# EAGLE design untitled (EAGLE 7.7.0)
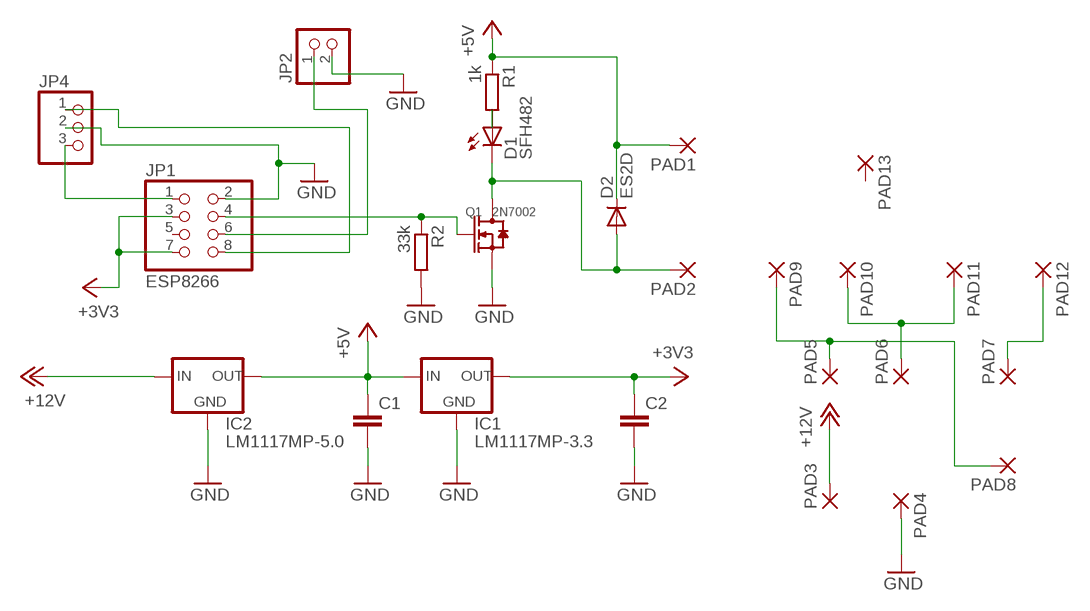
[diagram p0: schematic, sheet 1]

## Parts
C1  C-EUC1812  [C1812]
C2  C-EUC1812  [C1812]
D1  SFH482  [SFH482]
D2  ES2D  [SMB]
IC1  LM1117MP-3.3  [SOT223]
IC2  LM1117MP-5.0  [SOT223]
JP1  ESP8266  PINHD-2X4  [2X04]
JP2  PINHD-1X2  [1X02]
JP4  PINHD-1X3  [1X03]
PAD1  3,17/1,1  [3,17/1,1]
PAD2  3,17/1,1  [3,17/1,1]
PAD3  3,17/1,1  [3,17/1,1]
PAD4  3,17/1,1  [3,17/1,1]
PAD5  3,17/1,1  [3,17/1,1]
PAD6  3,17/1,1  [3,17/1,1]
PAD7  3,17/1,1  [3,17/1,1]
PAD8  3,17/1,1  [3,17/1,1]
PAD9  3,17/1,1  [3,17/1,1]
PAD10  3,17/1,1  [3,17/1,1]
PAD11  3,17/1,1  [3,17/1,1]
PAD12  3,17/1,1  [3,17/1,1]
PAD13  3,17/1,1  [3,17/1,1]
Q1  2N7002  SMD-MOSFET-N-CH-60V-300MA-LOGIC-LEVEL-FET-2N7002(SOT-23)  [SOT-23]
R1  1k  R-EU_M0805  [M0805]
R2  33k  R-EU_M0805  [M0805]

## Nets
+5V: C1.1 D2.C IC1.3(IN) IC2.2(OUT) IC2.4(OUT) PAD1.1(P) R1.1
+12V: IC2.3(IN) PAD3.1(P)
GND: C1.2 C2.2 IC1.1(GND) IC2.1(GND) JP1.2 JP2.2 JP4.2 PAD4.1(P) Q1.2(S) R2.2
N$2: JP1.1 JP4.3
N$3: JP1.4 Q1.1(G) R2.1
N$4: D1.K(C) D2.A PAD2.1(P) Q1.3(D)
N$5: D1.A R1.2
N$6: JP1.8 JP4.1
N$7: JP1.6 JP2.1
N$9: PAD5.1(P) PAD8.1(P) PAD9.1(P)
N$10: PAD6.1(P) PAD10.1(P) PAD11.1(P)
N$11: PAD7.1(P) PAD12.1(P)
N$17: C2.1 IC1.2(OUT) IC1.4(OUT) JP1.3 JP1.7 ; supply symbol labelled +3V3
Unconnected: JP1.5 PAD13.1(P)

## Library data of the parts
C1 C2 = rcl:C-EU: CAPACITOR, European symbol
D1 = led:SFH482: IR LED infrared emitting diode, Infineon
D2 = diode:ES2D: DIODE super fast rectifier, 2 A
IC1 = lm1117_11:LM1117?-*: 800mA Low-Dropout Linear Regulator Source: http://www.ti.com/lit/ds/symlink/lm1117-n.pdf; MF: Texas Instruments; MPN: LM1117MP-3.3; OC_FARNELL: 9778195; OC_NEWARK: 28X3416
IC2 = lm1117_11:LM1117?-*: 800mA Low-Dropout Linear Regulator Source: http://www.ti.com/lit/ds/symlink/lm1117-n.pdf; MF: Texas Instruments; MPN: LM1117MP-5.0; OC_FARNELL: 9778209; OC_NEWARK: 28X3417
JP1 = pinhead:PINHD-2X4: PIN HEADER
JP2 = pinhead:PINHD-1X2: PIN HEADER
JP4 = pinhead:PINHD-1X3: PIN HEADER
PAD1-PAD13 = wirepad:3,17/1,1: THROUGH-HOLE PAD
Q1 = Seeed-OPL-Transistor:SMD-MOSFET-N-CH-60V-300MA-LOGIC-LEVEL-FET-2N7002(SOT-23): 305030028; MPN: 2N7002,215
R1 R2 = rcl:R-EU_: RESISTOR, European symbol

## Board
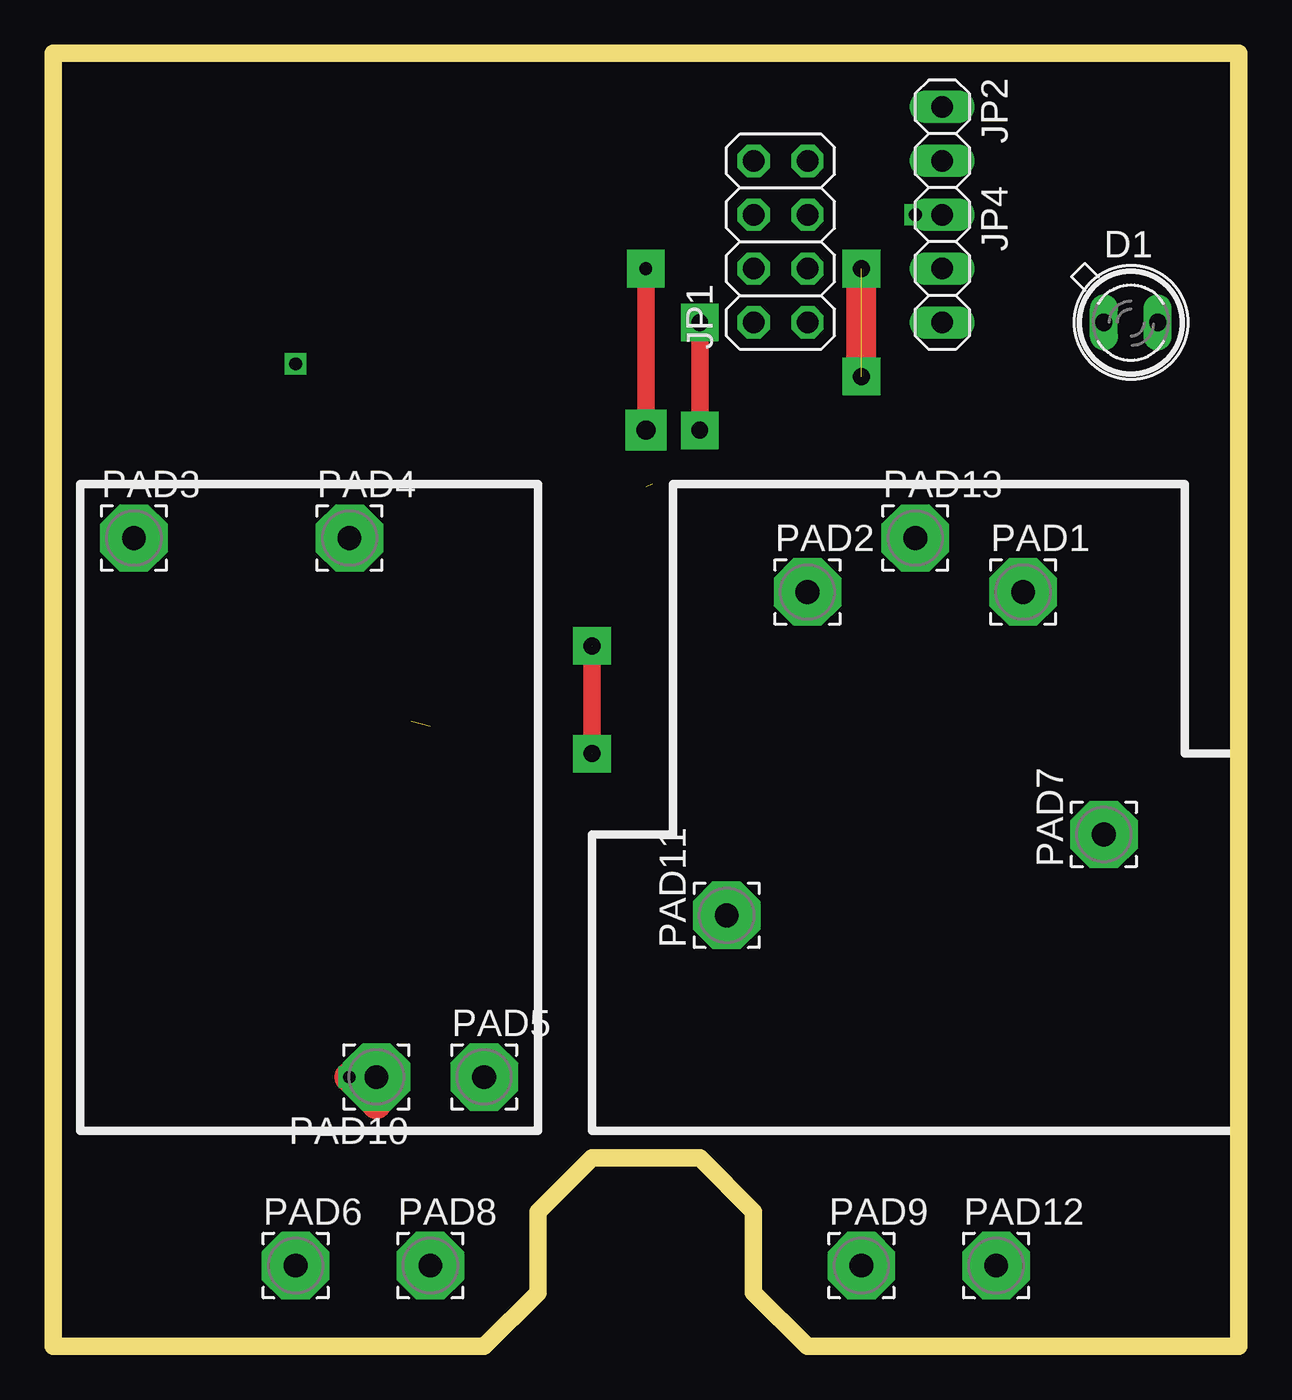
[diagram p1: board, top side]
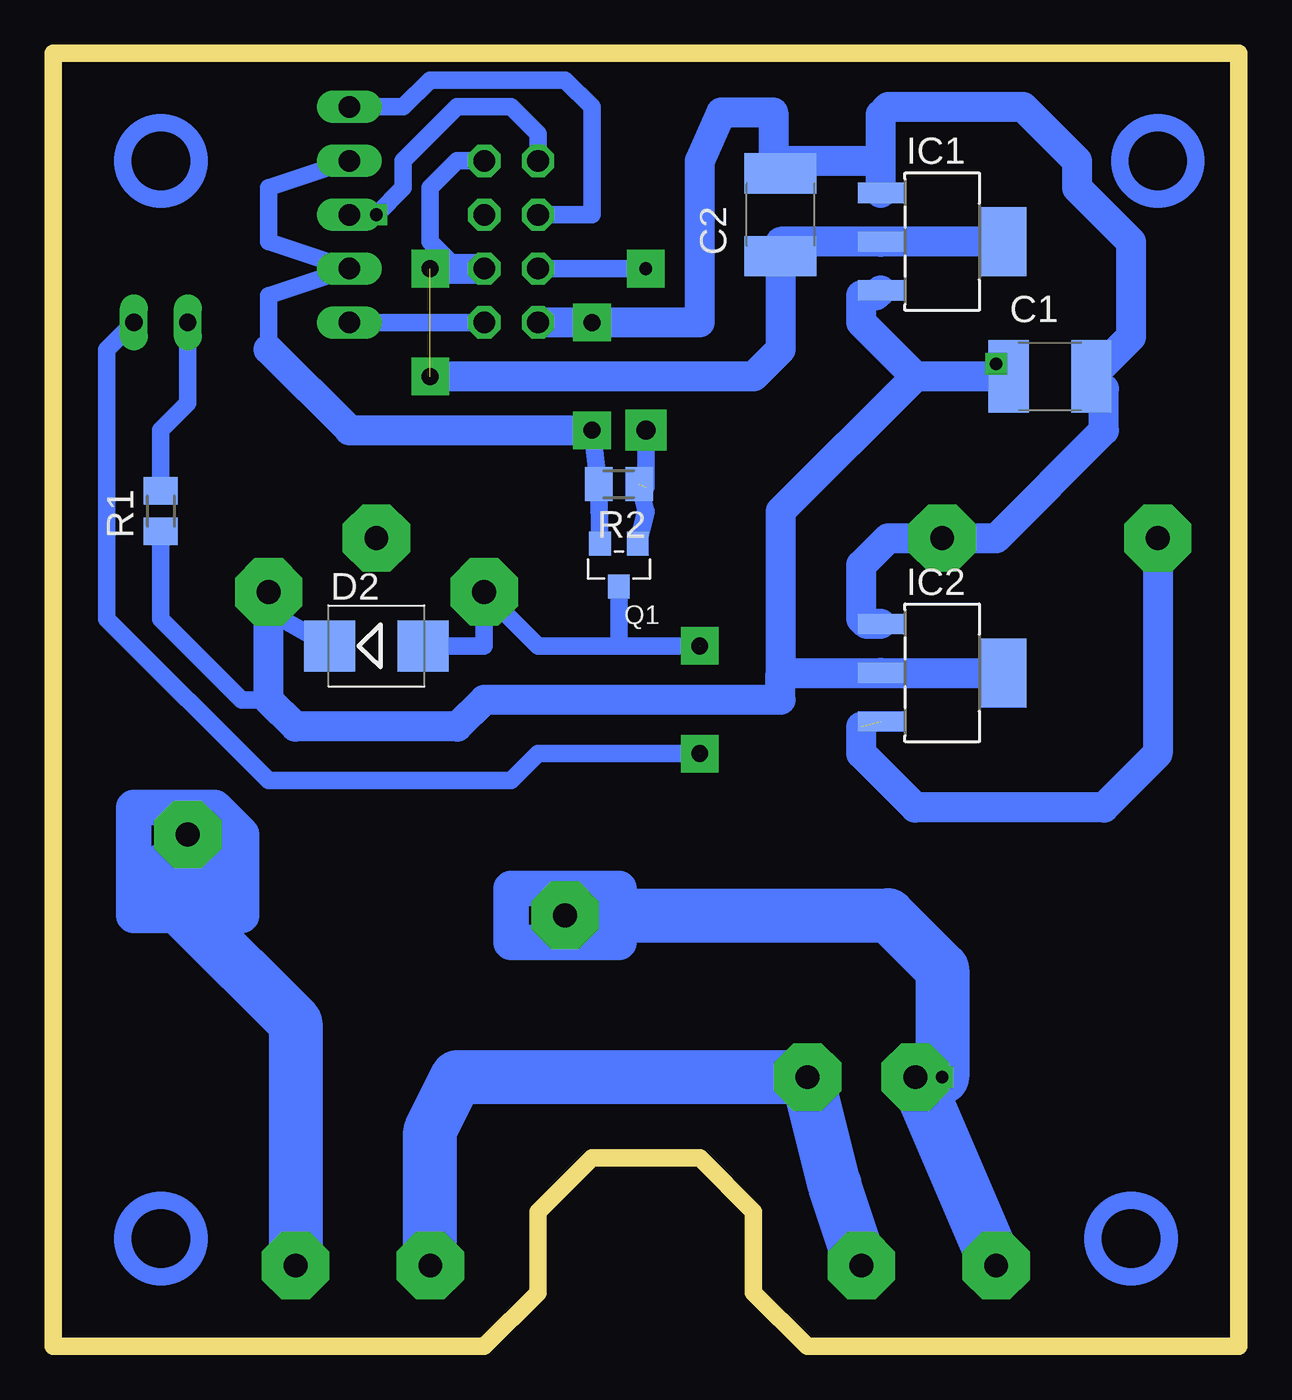
[diagram p2: board, bottom side, seen from below]

Size 55.88 x 60.96 mm. Coordinates in mm from the lower left corner, seen from the top.
Outline: 55.88,0 55.88,60.96 0,60.96 0,0 20.32,0 22.86,2.54 22.86,6.35 25.4,8.89 30.48,8.89 33.02,6.35 33.02,2.54 35.56,0 55.88,0
Copper layers (1*16): Top 0.035mm / dielectric 1.5mm / Bottom 0.035mm
Design rules "default": minimum track width 10mil, minimum drill 24mil, track to track 8mil, track to pad 8mil, pad to pad 8mil, via to via 8mil, smd to smd 8mil, copper to edge 40mil, drill to drill 8mil, minimum pad ring 10mil, minimum via ring 8mil, stop-mask expansion 4mil, vias tented up to drill 0mil, thermal gap 10mil

### Footprints (pad centres in the part's own frame; a part is rotated, then mirrored left to right if it is on the bottom)
C1812 = smd 1.9 x 3.4: 1 -1.95,0; 2 1.95,0
SFH482 = drill 0.813 long: A -1.27,0; K 1.27,0
SMB = smd 2.4 x 2.4: A 2.2,0; C -2.2,0
SOT223 = smd 0.95 x 2.15: 1 -2.3,-2.9; 2 0,-2.9; 3 2.3,-2.9 | smd 3.25 x 2.15: 4 0,2.9
2X04 = drill 1.016 octagon: 1 -3.81,-1.27; 2 -3.81,1.27; 3 -1.27,-1.27; 4 -1.27,1.27; 5 1.27,-1.27; 6 1.27,1.27; 7 3.81,-1.27; 8 3.81,1.27
1X02 = drill 1.016 long: 1 -1.27,0; 2 1.27,0
1X03 = drill 1.016 long: 1 -2.54,0; 2 0,0; 3 2.54,0
3,17/1,1 = drill 1.118 pad 3.175 octagon: 1 0,0
SOT-23 = smd 1.016 x 1.143: 1 -0.889,-1.016; 2 0.889,-1.016; 3 0,1.016
M0805 = smd 1.3 x 1.6: 1 -0.95,0; 2 0.95,0

### Placement (x,y rotation side)
C1  8.89,45.72 0 bottom
C2  21.59,53.34 90 bottom
D1  50.8,48.26 0 top
D2  40.64,33.02 0 bottom
IC1  13.97,52.07 270 bottom
IC2  13.97,31.75 270 bottom
JP1  34.29,52.07 90 top
JP2  41.91,57.15 270 top
JP4  41.91,50.8 270 top
PAD1  45.72,35.56 0 top
PAD2  35.56,35.56 0 top
PAD3  3.81,38.1 0 top
PAD4  13.97,38.1 0 top
PAD5  20.32,12.7 0 top
PAD6  11.43,3.81 0 top
PAD7  49.53,24.13 90 top
PAD8  17.78,3.81 0 top
PAD9  38.1,3.81 0 top
PAD10  15.24,12.7 180 top
PAD11  31.75,20.32 90 top
PAD12  44.45,3.81 0 top
PAD13  40.64,38.1 0 top
Q1  29.21,36.83 180 bottom
R1  50.8,39.37 90 bottom
R2  29.21,40.64 180 bottom

### Tracks (layer width: path | path; a pad name or v marks a point on that pad's centre or on a via)
+5V  (via drill 0.6)
  Top 0.813: 45.72,34.63 PAD1.1
  Bottom 0.813: v11.43,46.31 C1.1 | 45.72,30.48 46.99,30.48 50.8,34.29 R1.1 | D2.C 45.72,34.63
  Bottom 1.422: C1.1 15.24,45.72 | 15.24,45.72 21.59,39.37 21.59,31.75 | PAD1.1 45.72,30.48 44.45,29.21 36.83,29.21 35.56,30.48 21.59,30.48 21.59,31.75 | 21.59,31.75 IC2.2 IC2.4 | 15.24,45.72 17.78,48.26 17.78,49.53 17.11,49.53 IC1.3
+12V  (1 unrouted)
  Bottom 1.422: PAD3.1 3.81,27.94 6.35,25.4 15.24,25.4 17.78,27.94 17.78,29.21
GND  (via drill 0.8 pad 1.78)
  Top 0.813: v30.48,48.26 v30.48,43.18
  Bottom 0.813: JP2.2 45.72,54.61 45.72,52.07 JP4.2 45.72,49.53 45.72,46.99 | Q1.2 R2.2 v30.48,43.18
  Bottom 1.422: IC2.1 17.54,34.05 17.78,34.29 17.78,36.83 16.51,38.1 PAD4.1 11.43,38.1 6.35,43.18 6.35,45.13 C1.2 5.08,47.58 5.08,52.07 7.62,54.61 7.62,55.88 10.16,58.42 16.51,58.42 16.87,58.06 16.87,55.88 | IC1.1 16.87,55.88 | JP1.2 v30.48,48.26 25.4,48.26 25.4,55.88 24.38,58.17 21.93,58.17 21.93,55.63 C2.2 21.59,55.88 16.87,55.88 | 45.72,46.99 41.91,43.18 v30.48,43.18
N$2
  Bottom 0.813: JP1.1 JP4.3
N$3  (via drill 0.6 pad 1.78, 0.9 pad 1.93)  (1 unrouted)
  Top 0.813: v27.94,50.8 v27.94,43.18
  Bottom 0.813: JP1.4 v27.94,50.8 | v27.94,43.18 27.94,40.51 | Q1.1 27.94,39.37 R2.1
N$4  (2 unrouted)
  Top 0.813: 25.4,33.02 25.4,27.94
  Bottom 0.813: D2.A 35.56,33.02 PAD2.1 33.02,33.02 29.21,33.02 | 25.4,27.94 33.02,27.94 34.29,26.67 45.72,26.67 53.34,34.29 53.34,46.99 D1.K | 29.21,33.02 25.4,33.02 | Q1.3 29.21,33.02
N$5
  Bottom 0.813: R1.2 50.8,43.18 49.53,44.45 D1.A
N$6  (via drill 0.6)
  Top 0.813: JP4.1 v40.64,53.34
  Bottom 0.813: JP1.8 33.02,57.15 34.29,58.42 36.83,58.42 39.37,55.88 39.37,54.61 v40.64,53.34
N$7
  Bottom 0.813: JP2.1 39.37,58.42 38.1,59.69 31.75,59.69 30.48,58.42 30.48,53.34 JP1.6
N$9
  Bottom 2.54: PAD8.1 19.05,7.62 PAD5.1 36.83,12.7 38.1,10.16 PAD9.1
N$10  (via drill 0.6)
  Top 1.422: v13.97,12.7 15.24,11.43 PAD10.1
  Bottom 2.54: PAD11.1 16.51,20.32 13.97,17.78 v13.97,12.7 | PAD10.1 PAD6.1
N$11
  Bottom 2.54: PAD7.1 49.53,20.32 44.45,15.24 PAD12.1
N$13  (via drill 0.8 pad 1.78)  (1 unrouted)
  other vias: 38.1,45.72 38.1,50.8
N$14  (via drill 0.8 pad 1.78)
  other vias: 25.4,33.02
N$15  (via drill 0.8 pad 1.78)
  other vias: 25.4,27.94
N$17  (via drill 0.6)
  Top 1.422: v38.1,45.72 v38.1,50.8
  Bottom 0.813: JP1.7 36.83,55.88 38.1,54.61 38.1,52.07 36.83,50.8 JP1.3
  Bottom 1.422: IC1.4 IC1.2 21.59,52.07 C2.1 21.59,46.99 22.86,45.72 v38.1,45.72 | v38.1,50.8 JP1.3
N$18
  Bottom 1.676: 29.21,21.59 34.29,21.59 34.29,19.05 29.21,19.05
N$19
  Bottom 1.676: 48.26,24.13 48.26,20.32 50.8,20.32 50.8,21.59
N$20
  Bottom 1.676: 48.26,25.4 52.07,25.4 52.07,21.59 | 52.07,21.59 50.8,21.59 50.8,22.86 46.99,22.86 | 46.99,22.86 46.99,24.13 48.26,25.4 | 48.26,25.4 48.26,21.59 46.99,20.32 | 46.99,22.86 46.99,20.32 | 46.99,20.32 52.07,20.32 52.07,21.59
(copper drawn outside any net)
  shapes: Bottom circle x4